# Altium schematic sheet PAGE2 - PWR, MODULE.SchDoc (part 3 of 3)
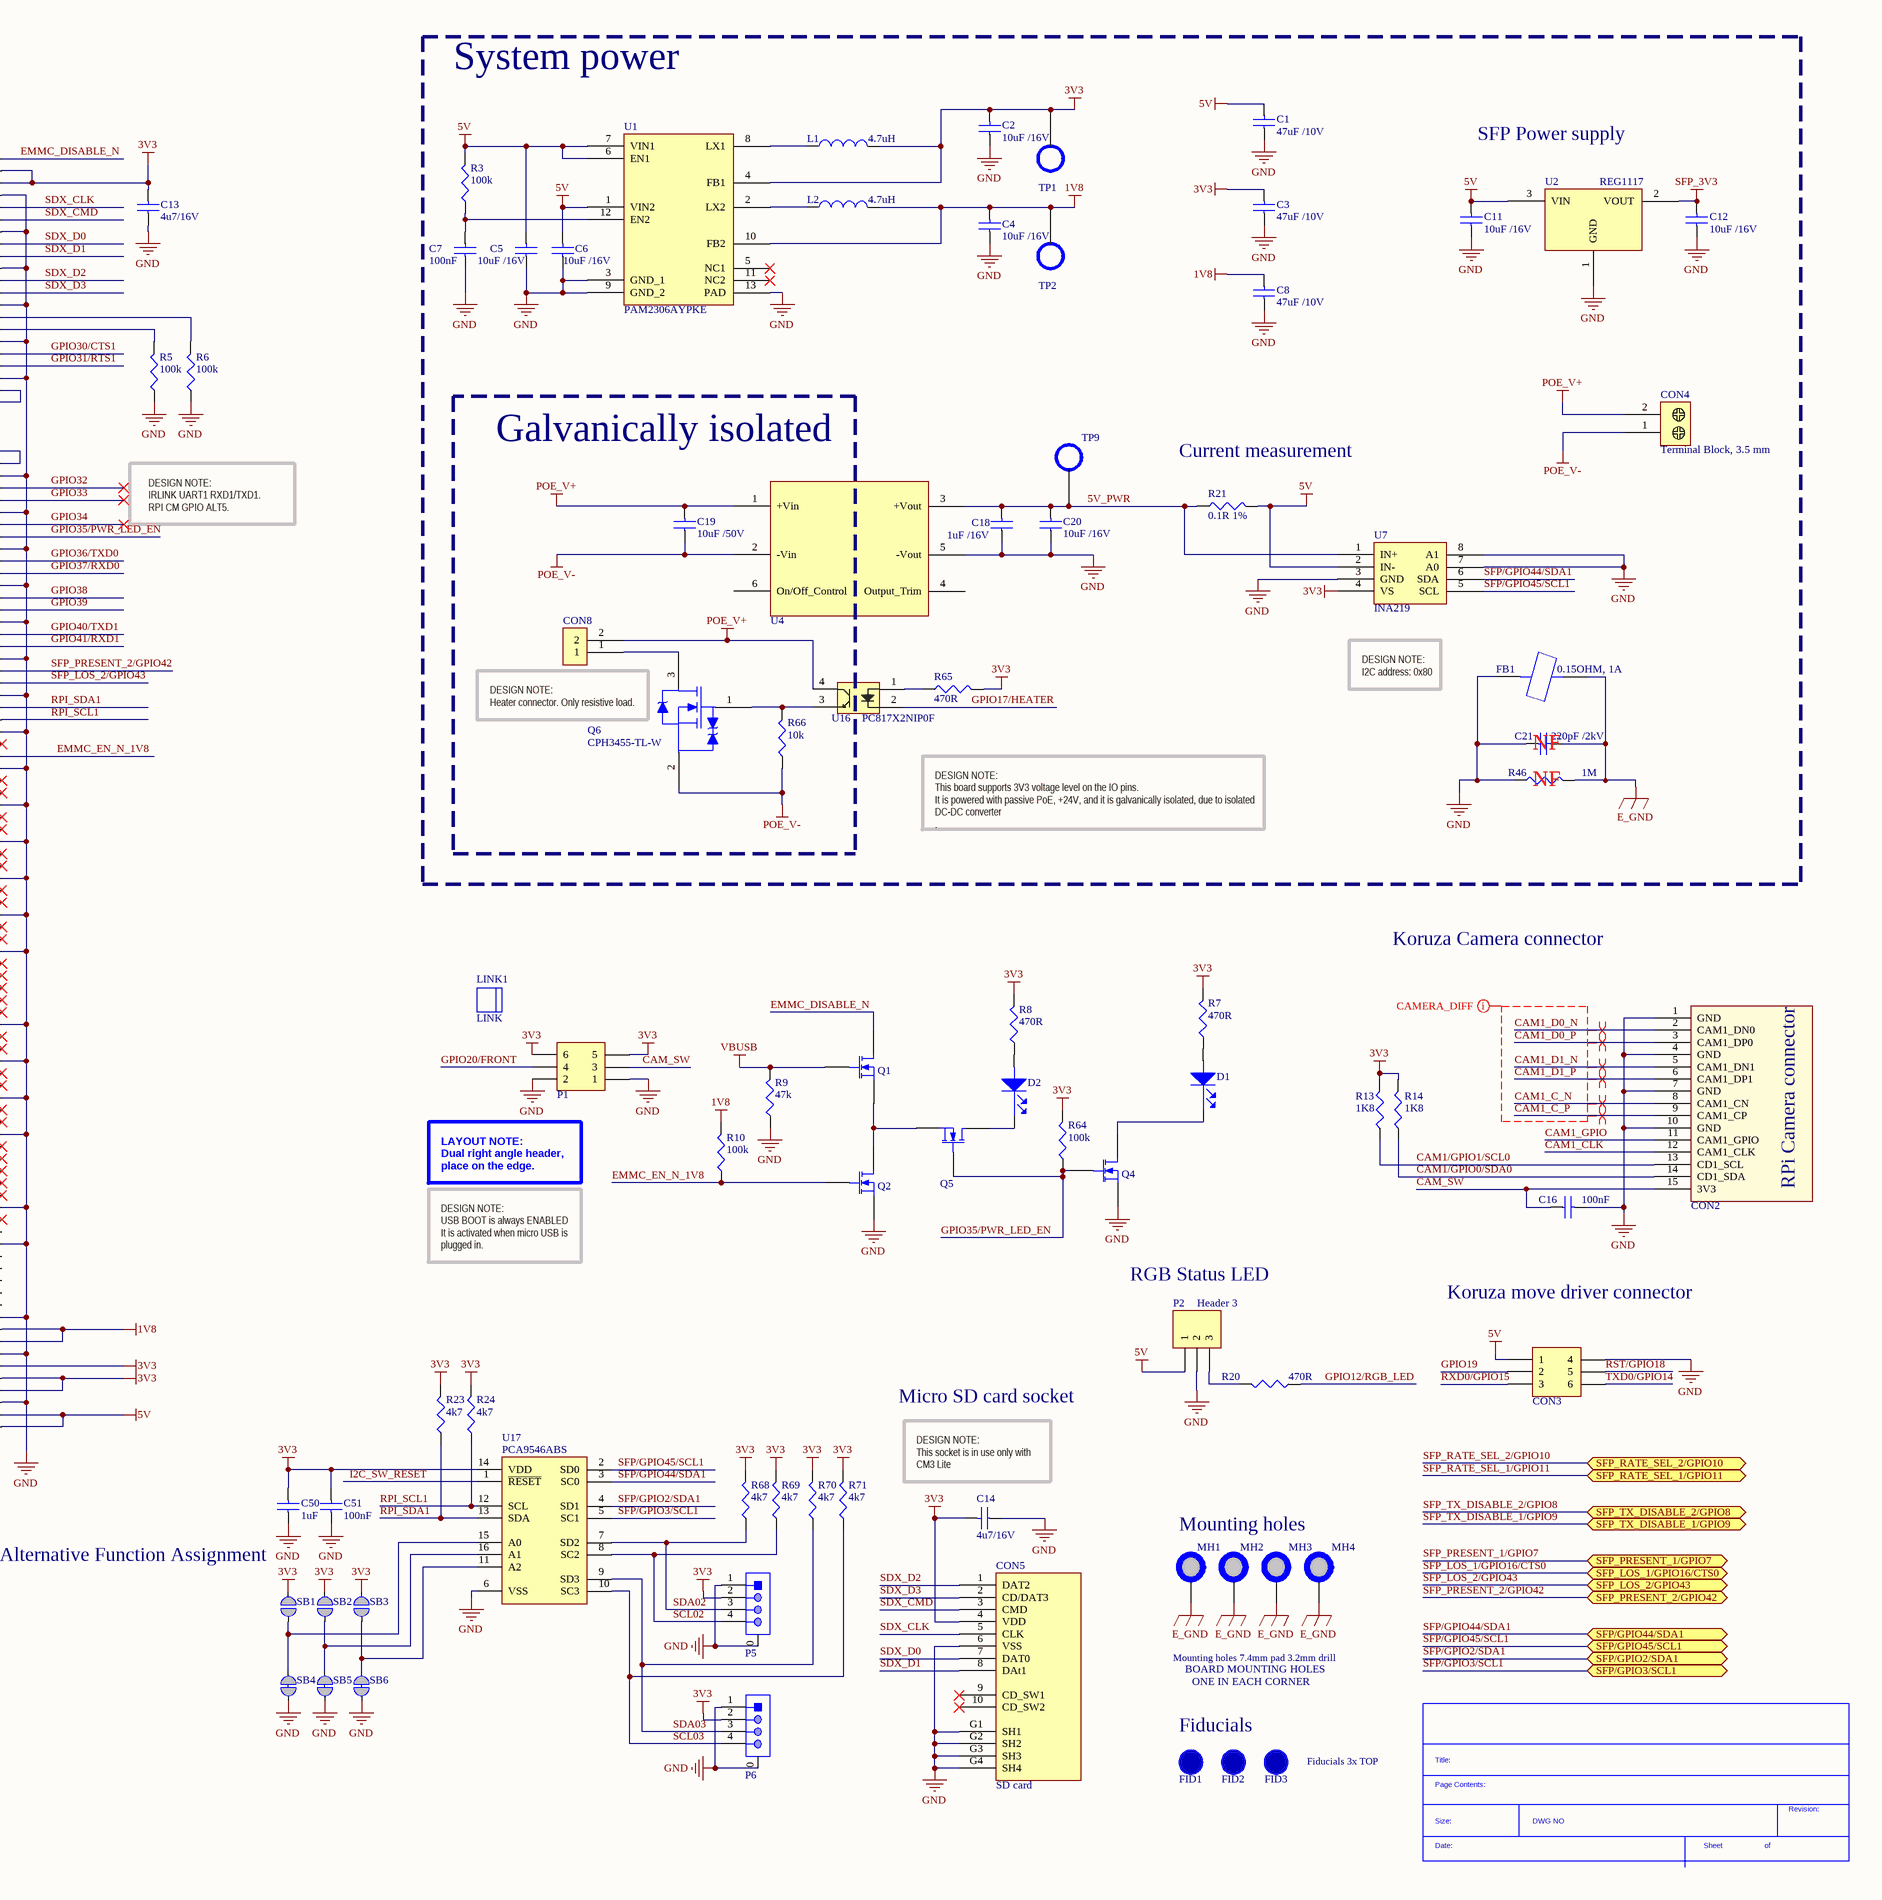
[diagram p3: PAGE2 - PWR, MODULE.SchDoc, right]

## Library data of the parts (continued)
U2 = REG1117: TEXAS INSTRUMENTS - REG1117 - V REG LDO ADJ +1.5/13.7V, SMD, 1117; Output Type: Adjustable; Input Voltage Min: 3.8; Input Voltage Max: 15; Adjustable Output Voltage Min: 1.5; Adjustable Output Voltage Max: 13.5; Output Current: 800; Dropout Voltage Vdo: 1.1; LDO Regulator Case Style: SOT-223; No. of Pins: 3; SVHC: No SVHC (15-Jun-2015); Accuracy %: 1%; Base Number: 1117; No. of Outputs: 1; Output Current Max: 0.8; Output Voltage Adjustable Range: 1.25V to 10; Voltage Regulator Type: Positive Adjustable<!--FANDB--><div class="features-and-benefits-container"><div class="features-and-benefits-description"><span class="features-benefits-value">The REG1117 is a 800mA low dropout Positive Regulator with variety of fixed-and adjustable-voltage versions. Output voltage of the adjustable versions is set with two external resistors. The REG1117 low dropout voltage allows its use with as little as 1; Supplier 1: Farnell; Manufacturer: TEXAS INSTRUMENTS; Manufacturer Part Number: REG1117; RoHS: TBA; Stock 1: 611; Pricing 1: 1=2.02, 10=1.53, 100=1.23, 250=1.06, 1000=0.887, 3000=0.861, 6000=0.835, 10000=0.809 (GBP); Fixed Output Voltage Nom.: -; Operating Temperature Min: -40; Operating Temperature Max: 125; Packaging: Each; Product Range: -; Automotive Qualification Standard: -; MSL: MSL 1 - Unlimited; Operating Temperature Range: 0°C to +125; Operating Voltage Tolerance +: 1%; Output Voltage: 13.5; Output Voltage Max: 13.5; Output Voltage Min: 1.5; Primary Input Voltage: 15; Supply Voltage Min: 3.8; Termination Type: Surface Mount Device; ComponentLink1URL: http://www.farnell.com/datasheets/1919259.pdf; ComponentLink1Description: http://www.farnell.com/datasheets/1919259.pdf; Supplier Part Number 1: 1097566
U4 = SPM15-050-Q12P-C: Isolated Board Mount DC/DC Converter, Medical, Fixed, 1 Output, 9 V, 36 V, 15 W, 5 V; Manufacturer: MURATA POWER SOLUTIONS; Input Voltage DC Min: 9; Input Voltage DC Max: 36; Output Power Max: 15; Output Voltage - Output 1: 5; Output Current - Output 1: 3; DC / DC Converter Type: DIP; DC / DC Converter Mounting: Through Hole; Approvals & Standards: CAN, CSA, IEC, UL; Product Range: SPM15 Series; SVHC: No SVHC (17-Dec-2015)<!--FANDB--><div class="features-and-benefits-container"><div class="features-and-benefits-description"><span class="features-benefits-value">The SPM15-050-Q12P-C is an isolated DC-DC Converter represents the next generation in Industrial Potted Module Technology. Featuring a full 15W output in one square inch of board area, the device isolated DC-DC converter offers efficient regulated DC power for printed circuit board mounting. The 1 x 1 x 0.41-inch converter accepts a wide range of input voltages, ideal for industrial applications. The converter offers a feature/option set including through-hole mounting, positive or negative logic (remote ON/OFF), overcurrent and overtemperature protection, under-voltage lockout. The input voltage range covers the standard Industrial requirements with a regulated output voltage and power rating up to 15W. Modules provide voltage isolation (basic insulation) from input to output of up to 1600V. .The Module delivers full output power to 70°C with no airflow. It is ideal for applications that do not require any heat sinking or forced air cooling.</span></div><div class="features-and-benefits-list"><ul class="features-and-benefits-list-list"><li class="features-and-benefits-list-item">High efficiency</li><li class="features-and-benefits-list-item">Monotonic start-up</li><li class="features-and-benefits-list-item">Continuous short circuit protection</li><li class="features-and-benefits-list-item">Low output ripple and noise</li><li class="features-and-benefits-list-item">Strong thermal derating characteristics</li><li class="features-and-benefits-list-item">Positive ON/OFF control logic</li><li class="features-and-benefits-list-item">1600V I/O isolation</li><li class="features-and-benefits-list-item">±0.1 Load and ±0.05% line maximum regulation</li><li class="features-and-benefits-list-item">88% Typical efficiency</li><li class="features-and-benefits-list-item">100; No. of Contacts: 20; Gender: Receptacle; Connector Type: SFP; Contact Termination Type: Solder; Connector Mounting: PCB Mount; Connector Mounting Orientation: Surface Mount; Manufacturer Part Number: SPM15-050-Q12P-C; Supplier 1: Farnell; Supplier Part Number 1: 2470131; RoHS: Y-EX; Stock 1: 84; Pricing 1: 1=29.43, 10=29.19, 25=28.95, 50=28.71 (GBP); DC / DC Converter Output Type: Fixed; No. of Outputs: 1 Output; Output Voltage - Output 2: -; Output Current - Output 2: -; Width: 25.4; Height: 10.41; Depth: 25.4; Output Voltage - Output 3: -; Output Current - Output 3: -; ComponentLink1URL: http://www.farnell.com/datasheets/1932853.pdf; ComponentLink1Description: http://www.farnell.com/datasheets/1932853.pdf; ComponentLink2URL: http://www.farnell.com/datasheets/2239469.pdf; ComponentLink2Description: http://www.farnell.com/datasheets/2239469.pdf; Supplier 2: Mouser; Supplier Part Number 2: 580-SPM15-050-Q12P-C; Contact Plating: Gold Plated Contacts; Contact Material: Phosphor Bronze; Colour: Black; Contact Termination: Solder; Flammability Rating: UL 94V-0; Material: Liquid Crystal Polymer (LCP); Packaging: Cut Tape; Termination Method: Solder<!--FANDB--><div class="features-and-benefits-container"><div class="features-and-benefits-description"><span class="features-benefits-value">The 1367073-1 is a 20-pin 1-port surface-mount SFP Connector with gold-plated phosphor bronze contacts and black LCP housing. The connector features integrated light pipes for port indicators, connectors with improved signal integrity, enhanced EMI springs for increased EMI suppression and riding heat sink technology for thermal management.</span></div><div class="features-and-benefits-list"><ul class="features-and-benefits-list-list"><li class="features-and-benefits-list-item">Supports applications up to 4Gbps</li><li class="features-and-benefits-list-item">Cages available in single port, ganged and stacked configurations</li><li class="features-and-benefits-list-item">Stacked cages have integrated connectors, press-fit in one process step</li><li class="features-and-benefits-list-item">Uses 20 position PT (pluggable transceiver) connector</li><li class="features-and-benefits-list-item">Direct attach copper cable assemblies for lower cost with short reach</li><li class="features-and-benefits-list-item">Integrated light pipes for port indicators</li><li class="features-and-benefits-list-item">Enhanced EMI springs for increased EMI suppression</li><li class="features-and-benefits-list-item">Riding heat sink technology for thermal management</li></ul></div><div class="features-and-benefits-applications"><ul class="features-and-benefits-value"><li class="features-and-benefits-list-item">Industrial</li></ul></div></div>; ComponentLink3URL: http://www.tycoelectronics.com/commerce/DocumentDelivery/DDEController?Action=srchrtrv&DocNm=1367073-1&DocType=Customer+View+Model&DocLang=English; ComponentLink3Description: http://www.tycoelectronics.com/commerce/DocumentDelivery/DDEController?Action=srchrtrv&DocNm=1367073-1&DocType=Customer+View+Model&DocLang=English; ComponentLink4URL: http://www.farnell.com/cad/1794462.pdf; ComponentLink4Description: http://www.farnell.com/cad/1794462.pdf; ComponentLink5URL: http://www.tycoelectronics.com/commerce/DocumentDelivery/DDEController?Action=srchrtrv&DocNm=408-8495&DocType=Specification+Or+Standard&DocLang=English; ComponentLink5Description: http://www.tycoelectronics.com/commerce/DocumentDelivery/DDEController?Action=srchrtrv&DocNm=408-8495&DocType=Specification+Or+Standard&DocLang=English; ComponentLink6URL: http://www.farnell.com/datasheets/1650946.pdf; ComponentLink6Description: http://www.farnell.com/datasheets/1650946.pdf
U7 = INA219AIDCNR: TEXAS INSTRUMENTS - INA219AIDCNR - CURRENT / POWER MONITOR, 120DB, 8SOT23; No. of Amplifiers: 1 Amplifier; Amplifier Case Style: SOT-23; No. of Pins: 8; Bandwidth: 3.4; Supply Voltage Min: 3; Supply Voltage Max: 5.5; Input Offset Voltage: 10; CMRR: 120; SVHC: No SVHC (15-Jun-2015); Supply Current: 700; Supply Voltage Range: 3V to 5.5V<!--FANDB--><div class="features-and-benefits-container"><div class="features-and-benefits-description"><span class="features-benefits-value">The INA219AIDCNR is a high-side Current Shunt and Power Monitor with an I²C interface. The INA219AIDCNR monitors both shunt drop and supply voltage, with programmable conversion times and filtering. A programmable calibration value, combined with an internal multiplier, enables direct readouts in amperes. An additional multiplying register calculates power in watts. The I²C interface features 16 programmable addresses. The INA219 is available in two grades; Supplier 1: Farnell; Manufacturer: TEXAS INSTRUMENTS; Manufacturer Part Number: INA219AIDCNR; RoHS: YES; Stock 1: 1771; Pricing 1: 1=1.87, 10=1.48, 25=1.33, 100=1.2, 250=1.13, 500=0.751 (GBP); Input Bias Current: -; Operating Temperature Min: -25; Operating Temperature Max: 85; Packaging: Cut Tape; Product Range: -; Automotive Qualification Standard: -; MSL: MSL 2 - 1 year; ComponentLink1URL: http://www.farnell.com/datasheets/2019169.pdf; ComponentLink1Description: http://www.farnell.com/datasheets/2019169.pdf; ComponentLink2URL: http://www.farnell.com/cad/1758439.zip; ComponentLink2Description: http://www.farnell.com/cad/1758439.zip; ComponentLink3URL: http://www.farnell.com/datasheets/2037325.pdf; ComponentLink3Description: http://www.farnell.com/datasheets/2037325.pdf; Supplier Part Number 1: 2295989
U16 = PC817X2NIP0F: SHARP - PC817X2NIP0F - OPTOCOUPLER, PHOTOTRANSISTOR, 5KV; No. of Channels: 1 Channel; Optocoupler Case Style: SMD; No. of Pins: 4; Forward Current If Max: 50; Isolation Voltage: 5; CTR Min: 50%; Collector Emitter Voltage V(br)ceo: 80; Product Range: PC8 Series; Output Voltage: 80V<!--FANDB--><div class="features-and-benefits-container"><div class="features-and-benefits-desc-container"><span class="features-and-benefits-container-desc">Optocoupler, Transistor Output, 1 Channel, SMD, 4 Pins, 50 mA, 5 kV, 50 %</span></div><div class="features-and-benefits-description"><span class="features-benefits-value">The PC817X2NIP0F is a Phototransistor Optocoupler with 1 channel and SnCu-plated copper alloy pin construction.</span></div><div class="features-and-benefits-list"><ul class="features-and-benefits-list-list"><li class="features-and-benefits-list-item">6V Reverse voltage</li><li class="features-and-benefits-list-item">70; Supplier 1: Farnell; Manufacturer: SHARP; Manufacturer Part Number: PC817X2NIP0F; RoHS: YES; Stock 1: 3897; Pricing 1: 1=0.367, 25=0.342, 100=0.247, 250=0.23, 500=0.213, 1000=0.141 (GBP); Packaging: Cut Tape; Input Current: 50; MSL: MSL 1 - Unlimited; Optocoupler Output Type: Phototransistor; ComponentLink1URL: http://www.farnell.com/datasheets/1812378.pdf; ComponentLink1Description: http://www.farnell.com/datasheets/1812378.pdf; Supplier Part Number 1: 2420054
U17 = INT - PCA9546ABS,118: Translating Switch, Bidirectional, 4 Inputs, 2.3V to 5.5V Supply, 25mA Out, 0.3ns Delay, HVQFN-16; Manufacturer: NXP; Supplier 1: Farnell; Supplier Part Number 1: 2775989; Manufacturer Part Number 2: PCA9546ABS,118